# Altium project UZ_PER_loopback_tutorial.PrjPcb
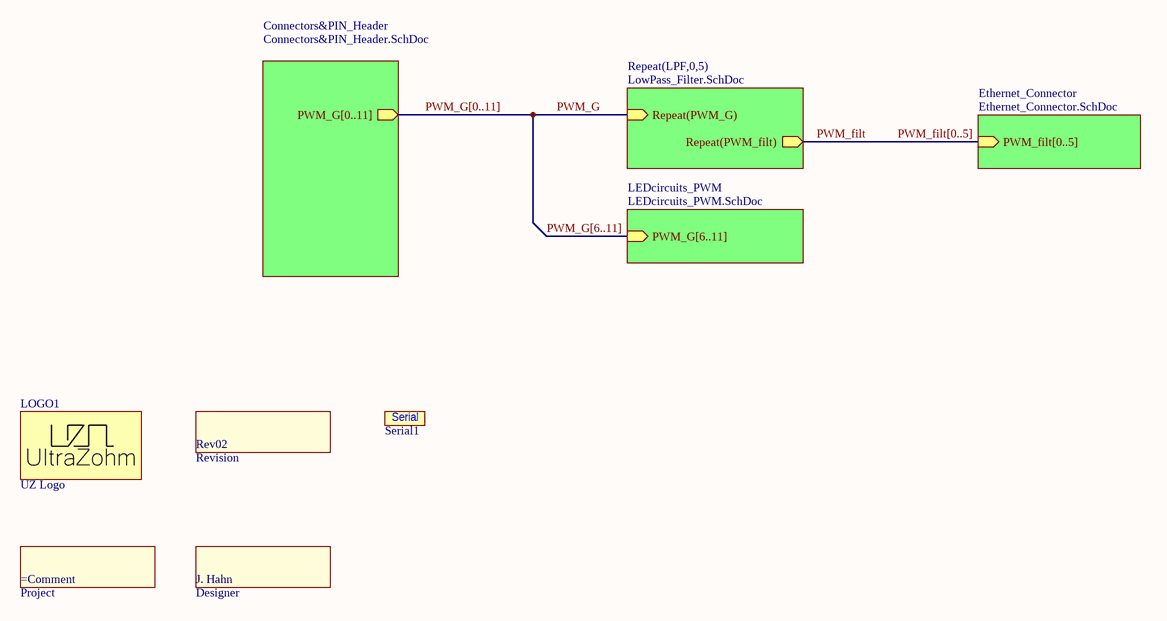
[diagram p0: Interface_TopSheet.SchDoc]
Author: J. Hahn; AuthorParam: J. Hahn; ProjectNameCustom: uz_per_loopback_tutorial; ProjectRevision: Rev02; Website: www.ultrazohm.com
5 sheets, 65 parts. Net scope: hierarchical (ports join the sheet entries above them; power ports are global).
Board file: UZ_PER_loopback_tutorial.PcbDoc
Sheets:
  Interface_TopSheet.SchDoc
    Connectors&PIN_Header = Connectors&PIN_Header.SchDoc
    LPF0 = LowPass_Filter.SchDoc
    LPF1 = LowPass_Filter.SchDoc
    LPF2 = LowPass_Filter.SchDoc
    LPF3 = LowPass_Filter.SchDoc
    LPF4 = LowPass_Filter.SchDoc
    LPF5 = LowPass_Filter.SchDoc
    Ethernet_Connector = Ethernet_Connector.SchDoc
    LEDcircuits_PWM = LEDcircuits_PWM.SchDoc

## Sheet Interface_TopSheet.SchDoc
size A4; Author: J. Hahn; CompanyName: Technische Hochschule Nürnberg Georg Simon Ohm; Organization: UltraZohm; Address1: Kesslerplatz 12; Address2: 90489 Nürnberg; Address3: GERMANY; SheetNumber: 1; SheetTotal: 5; Website: www.ultrazohm.com

### Parts
Designer  value J. Hahn  [Designator:comment]  (no BOM)
LOGO1  UZ Logo  [UZ_Logo_small]  (no BOM)
Project  (no value)  [COMMENT]  (no BOM)
Revision  value Rev02  [Designator:comment]  (no BOM)
Serial1  Serial #  [SERIAL]  (value not drawn)

### Sub-sheets
Connectors&PIN_Header = Connectors&PIN_Header.SchDoc: PWM_G[0..11] (out)
Ethernet_Connector = Ethernet_Connector.SchDoc: PWM_filt[0..5] (in)
LEDcircuits_PWM = LEDcircuits_PWM.SchDoc: PWM_G[6..11] (in)
Repeat(LPF,0,5) = LowPass_Filter.SchDoc: Repeat(PWM_G) (in), Repeat(PWM_filt) (out)

### Nets
PWM_filt: sheet Repeat(LPF,0,5)/Repeat(PWM_filt)
PWM_G: sheet Repeat(LPF,0,5)/Repeat(PWM_G)

### Buses and harness runs
bus PWM_filt[0..5] = sheet Ethernet_Connector/PWM_filt[0..5]
bus PWM_G[0..11] = sheet Connectors&PIN_Header/PWM_G[0..11]
bus PWM_G[6..11] = sheet LEDcircuits_PWM/PWM_G[6..11]

### Notes on the sheet
- Title
- Revision:
- Design Engineer:
- Date:
- Project:
- Sheet
- of
- (in symbol 6) Serial

### Library data of the parts
Designer = 4: Create a project parameter named "Author" this is the value of this component. It is printed on the PCB. Once the parameter is updated (e.g. new revision) it gets updated on the PCB as well; Manufacturer: PCB Manufacturer; Manufacturer Part Number: Project Author; Created from: T. Wendt; PartID: 4; Created On: 01.03.2021 08:53:41; Component Type: Project Author; Last Updated: 01.03.2021 09:20:27; Type: Standard (No BOM); Live Cycle Status: 1
LOGO1 = Logo small: Manufacturer: UltraZohm; Created from: MGremer; Created: Jan2021_Liegmann; Value: Logo; Manufacturer Part Number: Logo small; PartID: 10; Created On: 03.11.2021 09:04:23; ComponentLink1Description: https://docs.ultrazohm.com/; ComponentLink1URL: homepage; Component Type: Logo; Last Updated: 03.11.2021 09:05:50; Supplier 1: -; Supplier Part Number 1: -; Type: Logo; Live Cycle Status: 1
Project = 2: Create a project parameter named "ProjectNameCustom" this is the value of this component and it is printed on the PCB.; Manufacturer: PCB Manufacturer; Value: uz_per_loopback_tutorial; Created from: T. Wendt; PartID: 2; Created On: 01.03.2021 08:43:57; Component Type: Project Name; Last Updated: 01.03.2021 09:07:27; Manufacturer Part Number: Project Name; Type: Standard (No BOM); Live Cycle Status: 1
Revision = 3: Create a project parameter named "ProjectRevision" this is the value of this component. It is printed on the PCB. Once the parameter is updated (e.g. new revision) it gets updated on the PCB as well; Manufacturer: PCB Manufacturer; Created from: T. Wendt; PartID: 3; Created On: 01.03.2021 08:50:34; Component Type: Project Revision; Last Updated: 01.03.2021 09:28:36; Manufacturer Part Number: Project Revision; Type: Standard (No BOM); Live Cycle Status: 1
Serial1 = 6: Field to put in a serial number; Manufacturer: PCB Manufacturer; Created from: T. Wendt; PartID: 6; Created On: 02.03.2021 14:31:24; Component Type: Serial Number; Last Updated: 02.03.2021 14:31:24; Manufacturer Part Number: Serial Number; Type: Standard (No BOM); Live Cycle Status: 1

## Sheet Connectors&PIN_Header.SchDoc
size A4; Author: J. Hahn; CompanyName: Technische Hochschule Nürnberg Georg Simon Ohm; Organization: UltraZohm; Address1: Kesslerplatz 12; Address2: 90489 Nürnberg; Address3: GERMANY; SheetNumber: 2; SheetTotal: 5; Website: www.ultrazohm.com
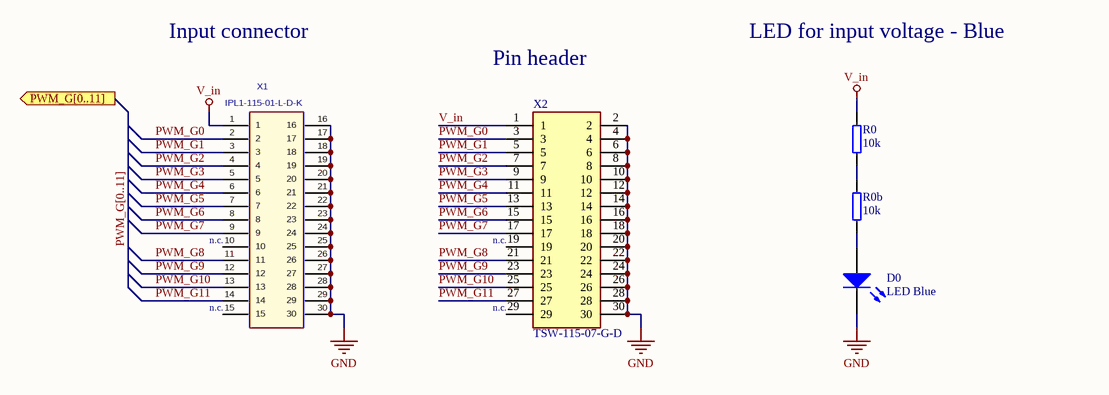
[diagram p1: Connectors&PIN_Header.SchDoc]

### Parts
D0  LED Blue  [WL-SMCW_0603]
R0  10k  [RES 0603_1608]
R0b  10k  [RES 0603_1608]
X1  IPL1-115-01-L-D-K  [IPL1-115-01-YYY-D-K]
X2  TSW-115-07-G-D  [TSW-115-XX-YY-D]

### Ports
PWM_G[0..11] (out)

### Nets
GND: D0.1(K) X1.16 X1.17 X1.18 X1.19 X1.20 X1.21 X1.22 X1.23 X1.24 X1.25 X1.26 X1.27 X1.28 X1.29 X1.30 X2.2 X2.4 X2.6 X2.8 X2.10 X2.12 X2.14 X2.16 X2.18 X2.20 X2.22 X2.24 X2.26 X2.28 X2.30
V_in: R0.2 X1.1 X2.1
PWM_G0: X1.2 X2.3
PWM_G1: X1.3 X2.5
PWM_G2: X1.4 X2.7
PWM_G3: X1.5 X2.9
PWM_G4: X1.6 X2.11
PWM_G5: X1.7 X2.13
PWM_G6: X1.8 X2.15
PWM_G7: X1.9 X2.17
PWM_G8: X1.11 X2.21
PWM_G9: X1.12 X2.23
PWM_G10: X1.13 X2.25
PWM_G11: X1.14 X2.27
NetD0_2: D0.2(A) R0b.1
NetR0_1: R0.1 R0b.2

Not connected (* = marked no-connect by the designer): X1 10 15; X2 19 29

### Buses and harness runs
bus PWM_G[0..11] = port PWM_G[0..11]

### Notes on the sheet
- Input connector
- LED for input voltage - Blue
- Pin header
- (near X1) n.c.
- (near X2) n.c.
- Title
- Revision:
- Design Engineer:
- Date:
- Project:
- Sheet
- of

### Library data of the parts
D0 = UZgen_LED_0603_Blue: Standard LEDs - SMD 0603 blue; Manufacturer: UZgen; Created from: UZgenTool; Manufacturer Part Number: UZgen_LED_0603_Blue; PartID: 20; Created On: 09.09.2024 10:45:01; ComponentLink1Description: N/A; ComponentLink1URL: N/A; Component Type: LED Diode; Device Package: 0603; Last Updated: 09.09.2024 10:45:01; Mounting Type: SMD; Supplier 1: LCSC; Supplier Part Number 1: C5197644; Type: Standard; Value: LED Blue; Live Cycle Status: 1; Stock number: not stored; Color: blue; LCSC Part Number: C5197644
R0 R0b = RQ73C1J10KBTD: SMD resistor 0.1%, 10ppm; Manufacturer: TE Connectivity; Created from: DHufnagel; Manufacturer Part Number: RQ73C1J10KBTD; PartID: 231; Created On: 14.12.2020 16:17:14; ComponentLink1Description: Datasheet; ComponentLink1URL: https://www.mouser.de/datasheet/2/418/5/ENG_DS_1773270_2_B-1533717.pdf; Component Type: SMD resistor; Device Package: 0603; Last Updated: 21.02.2024 15:51:17; Mounting Type: SMD; Supplier 1: Mouser; Supplier Part Number 1: 279-RQ73C1J10KBTD; Supplier 2: LCSC; Supplier Part Number 2: C25804; Type: Resistor; Tolerance: 0.1%; Value: 10k; Live Cycle Status: 1; Stock number: not stored; LCSC Part Number: C25804
X1 = IPL1-115-01-L-D-K: 2.54 mm Double Row Terminal Assembly; Manufacturer: SAMTEC; Created from: MGremer; Number of positions: 30; Manufacturer Part Number: IPL1-115-01-L-D-K; PartID: 28; Created On: 01.12.2020 18:14:32; ComponentLink1Description: Homepage; ComponentLink1URL: https://www.samtec.com/de/products/ipl1; Component Type: Samtec Connector; Device Package: Connector; Last Updated: 15.02.2021 10:08:03; Mounting Type: THT; Supplier 1: SAMTEC; Supplier Part Number 1: IPL1-115-01-L-D-K; Type: Connector; Live Cycle Status: 1; Number of rows: 2; Stock number: not stored; LCSC Part Number: C17431809
X2 = TSW-115-07-G-D: 2x15 Pins; Manufacturer_Name: SAMTEC; Created from: JHahn; Mouser Part Number: 200-TSW11507GD; Mouser Price/Stock: https://www.mouser.co.uk/ProductDetail/Samtec/TSW-115-07-G-D?qs=rU5fayqh%252BE0Fz7QdY5Xmuw%3D%3D; Manufacturer_Part_Number: TSW-115-07-G-D; Datasheet Link: http://suddendocs.samtec.com/prints/tsw-xxx-xx-xxx-x-xx-xxx-mkt.pdf; Manufacturer Part Number: TSW-115-07-G-D; PartID: 18; Created On: 07.04.2026 13:32:57; ComponentLink1Description: Datasheet; ComponentLink1URL: http://suddendocs.samtec.com/prints/tsw-xxx-xx-xxx-x-xx-xxx-mkt.pdf; Component Type: Pin Header; Device Package: THT; Last Updated: 07.04.2026 14:32:10; Manufacturer: SAMTEC; Mounting Type: THT; Operating Temperature: -55 +125 °C; Series: TSW; Supplier 1: Mouser; Supplier Part Number 1: 200-TSW11507GD; Type: Pin Header; Live Cycle Status: 1; LCSC Part Number: C5994596; Stock number: 15

## Sheet LowPass_Filter.SchDoc
size A4; Author: J. Hahn; CompanyName: Technische Hochschule Nürnberg Georg Simon Ohm; Organization: UltraZohm; Address1: Kesslerplatz 12; Address2: 90489 Nürnberg; Address3: GERMANY; SheetNumber: 3; SheetTotal: 5; Website: www.ultrazohm.com
Used 6 times, as channels LPF0, LPF1, LPF2, LPF3, LPF4, LPF5. Parts and nets are listed once, with the designators drawn on the sheet.
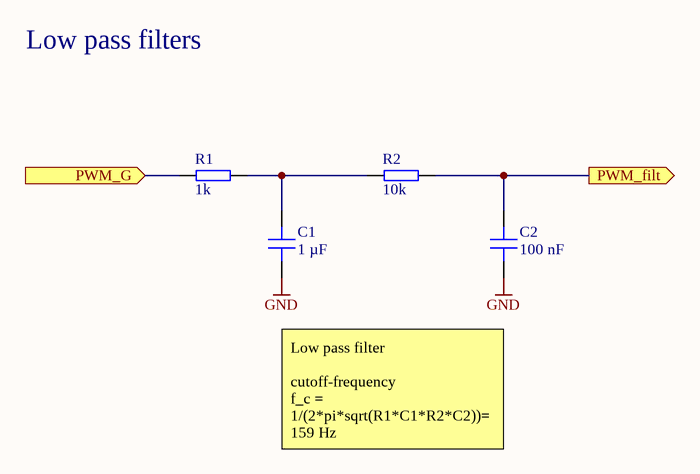
[diagram p2: LowPass_Filter.SchDoc]

### Parts
C1  1 µF  [C_0603]
C2  100 nF  [C_0603]
R1  1k  [RES 0603_1608]
R2  10k  [RES 0603_1608]

### Ports
PWM_filt (out), PWM_G (in)

### Nets
GND: C1.1 C2.1
PWM_filt: C2.2 R2.2 ; port PWM_filt
PWM_G: R1.1 ; port PWM_G
NetC1_2: C1.2 R1.2 R2.1

### Channels
LPF0: designators C1=LPF0_C1 C2=LPF0_C2 R1=LPF0_R1 R2=LPF0_R2; ports PWM_filt=PWM_filt0 PWM_G=PWM_G0
LPF1: designators C1=LPF1_C1 C2=LPF1_C2 R1=LPF1_R1 R2=LPF1_R2; ports PWM_filt=PWM_filt1 PWM_G=PWM_G1
LPF2: designators C1=LPF2_C1 C2=LPF2_C2 R1=LPF2_R1 R2=LPF2_R2; ports PWM_filt=PWM_filt2 PWM_G=PWM_G2
LPF3: designators C1=LPF3_C1 C2=LPF3_C2 R1=LPF3_R1 R2=LPF3_R2; ports PWM_filt=PWM_filt3 PWM_G=PWM_G3
LPF4: designators C1=LPF4_C1 C2=LPF4_C2 R1=LPF4_R1 R2=LPF4_R2; ports PWM_filt=PWM_filt4 PWM_G=PWM_G4
LPF5: designators C1=LPF5_C1 C2=LPF5_C2 R1=LPF5_R1 R2=LPF5_R2; ports PWM_filt=PWM_filt5 PWM_G=PWM_G5

### Notes on the sheet
- Low pass filters
- Low pass filter
  cutoff-frequency
  f_c = 1/(2*pi*sqrt(R1*C1*R2*C2))= 159 Hz
- Title
- Revision:
- Design Engineer:
- Date:
- Project:
- Sheet
- of

### Library data of the parts
C1 = UMK107AB7105KA-T: 50V 1uF X7R ±10% 0603 Multilayer Ceramic Capacitors MLCC - SMD/SMT ROHS; Manufacturer: Taiyo Yuden; Voltage Rating: 50 VDC; Created from: NDiringer; Manufacturer Part Number: UMK107AB7105KA-T; PartID: 98; Created On: 09.08.2022 09:35:02; ComponentLink1Description: Datasheet; ComponentLink1URL: https://www.mouser.de/datasheet/2/396/mlcc02_e-1307760.pdf; Component Type: Capacitor 0603; Device Package: 0603; Last Updated: 21.09.2022 16:11:37; Mounting Type: SMD; Operating Temperature: -55 - 125°C; Series: X7R; Supplier 1: LCSC; Supplier Part Number 1: C15849; Supplier 2: Mouser; Supplier Part Number 2: 963-UMK107AB7105MA-T; Type: Capacitor; Tolerance: 10 %; Value: 1 µF; Live Cycle Status: 1; LCSC Part Number: C15849; Stock number: not stored
C2 = C0603C104K5RAC3121: Capacitor 0603, 50 VDC, 100nF, X7R; Manufacturer: KEMET; Tolerance: 10 %; Voltage Rating: 50 VDC; Created from: DHufnagel; Manufacturer Part Number: C0603C104K5RAC3121; PartID: 99; Created On: 11.08.2022 14:33:29; ComponentLink1Description: Datasheet; ComponentLink1URL: https://www.mouser.de/datasheet/2/212/KEM_C1023_X7R_AUTO_SMD-1093309.pdf; Component Type: Capacitor 0603; Device Package: 0603; Last Updated: 19.08.2022 08:26:58; Mounting Type: SMD; Operating Temperature: -55 - 125°C; Series: X7R; Supplier 1: Mouser; Supplier Part Number 1: 80-C603C104K5RAC3121; Supplier 2: LCSC; Supplier Part Number 2: C14663; Type: Capacitor; Value: 100 nF; Live Cycle Status: 1; LCSC Part Number: C14663; Stock number: not stored
R1 = PCF-W0603LF-03-1001-B-P-LT: SMD resistor 0.1%; Manufacturer: IRC / TT Electronics; Created from: MGremer; Manufacturer Part Number: PCF-W0603LF-03-1001-B-P-LT; PartID: 163; Created On: 14.12.2020 16:17:14; ComponentLink1Description: Datasheet; ComponentLink1URL: https://www.mouser.de/datasheet/2/414/PCF-1528243.pdf; Component Type: SMD resistor; Device Package: 0603; Last Updated: 21.02.2024 15:45:55; Mounting Type: SMD; Supplier 1: Mouser; Supplier Part Number 1: 66-PCFW0603LF031001B; Type: Resistor; Tolerance: 0.1%; Value: 1k; Live Cycle Status: 1; Stock number: not stored; LCSC Part Number: C110776
R2 = RQ73C1J10KBTD: as R0 on sheet Connectors&PIN_Header; Manufacturer Part Number: RQ73C1J10KBTD; PartID: 231; Created On: 14.12.2020 16:17:14; ComponentLink1Description: Datasheet; ComponentLink1URL: https://www.mouser.de/datasheet/2/418/5/ENG_DS_1773270_2_B-1533717.pdf; Component Type: SMD resistor; Device Package: 0603; Last Updated: 21.02.2024 15:51:17; Mounting Type: SMD; Supplier 1: Mouser; Supplier Part Number 1: 279-RQ73C1J10KBTD; Supplier 2: LCSC; Supplier Part Number 2: C25804; Type: Resistor; Tolerance: 0.1%; Value: 10k; Live Cycle Status: 1; Stock number: not stored; LCSC Part Number: C25804

## Sheet Ethernet_Connector.SchDoc
size A4; Author: J. Hahn; CompanyName: Technische Hochschule Nürnberg Georg Simon Ohm; Organization: UltraZohm; Address1: Kesslerplatz 12; Address2: 90489 Nürnberg; Address3: GERMANY; SheetNumber: 5; SheetTotal: 5; Website: www.ultrazohm.com
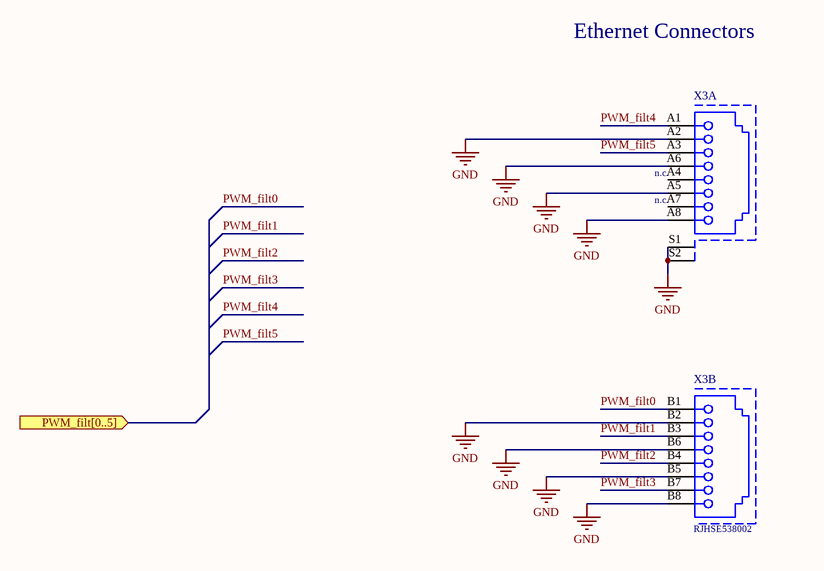
[diagram p3: Ethernet_Connector.SchDoc]

### Parts
X3  (no value)  [RJHSE-5380-02]  (parts A,B of 2)

### Ports
PWM_filt[0..5] (in)

### Nets
GND: X3.A2 X3.A5 X3.A6 X3.A8 X3.B2 X3.B5 X3.B6 X3.B8 X3.S1 X3.S2
PWM_filt0: X3.B1
PWM_filt1: X3.B3
PWM_filt2: X3.B4
PWM_filt3: X3.B7
PWM_filt4: X3.A1
PWM_filt5: X3.A3

Not connected (* = marked no-connect by the designer): X3 A4 A7

### Notes on the sheet
- Ethernet Connectors
- (near X3) n.c.
- Title
- Revision:
- Design Engineer:
- Date:
- Project:
- Sheet
- of

### Library data of the parts
X3 = RJHSE538002: CAT5, RJ45 Connector, 1x2; Manufacturer: Amphenol; Created from: MGremer; Manufacturer Part Number: RJHSE538002; PartID: 4; Created On: 22.02.2021 16:43:38; ComponentLink1Description: Datasheet; ComponentLink1URL: https://www.farnell.com/cad/2360382.pdf; Component Type: RJ45 Connector; Device Package: RJ45; Last Updated: 22.02.2021 16:43:38; Mounting Type: THT; Series: RJHSE; Supplier 1: Farnell; Supplier Part Number 1: 1860605; Type: RJ45 Connector; Live Cycle Status: 1; Stock number: not stored; LCSC Part Number: C47326523

## Sheet LEDcircuits_PWM.SchDoc
size A4; Author: J. Hahn; CompanyName: Technische Hochschule Nürnberg Georg Simon Ohm; Organization: UltraZohm; Address1: Kesslerplatz 12; Address2: 90489 Nürnberg; Address3: GERMANY; SheetNumber: 4; SheetTotal: 5; Website: www.ultrazohm.com
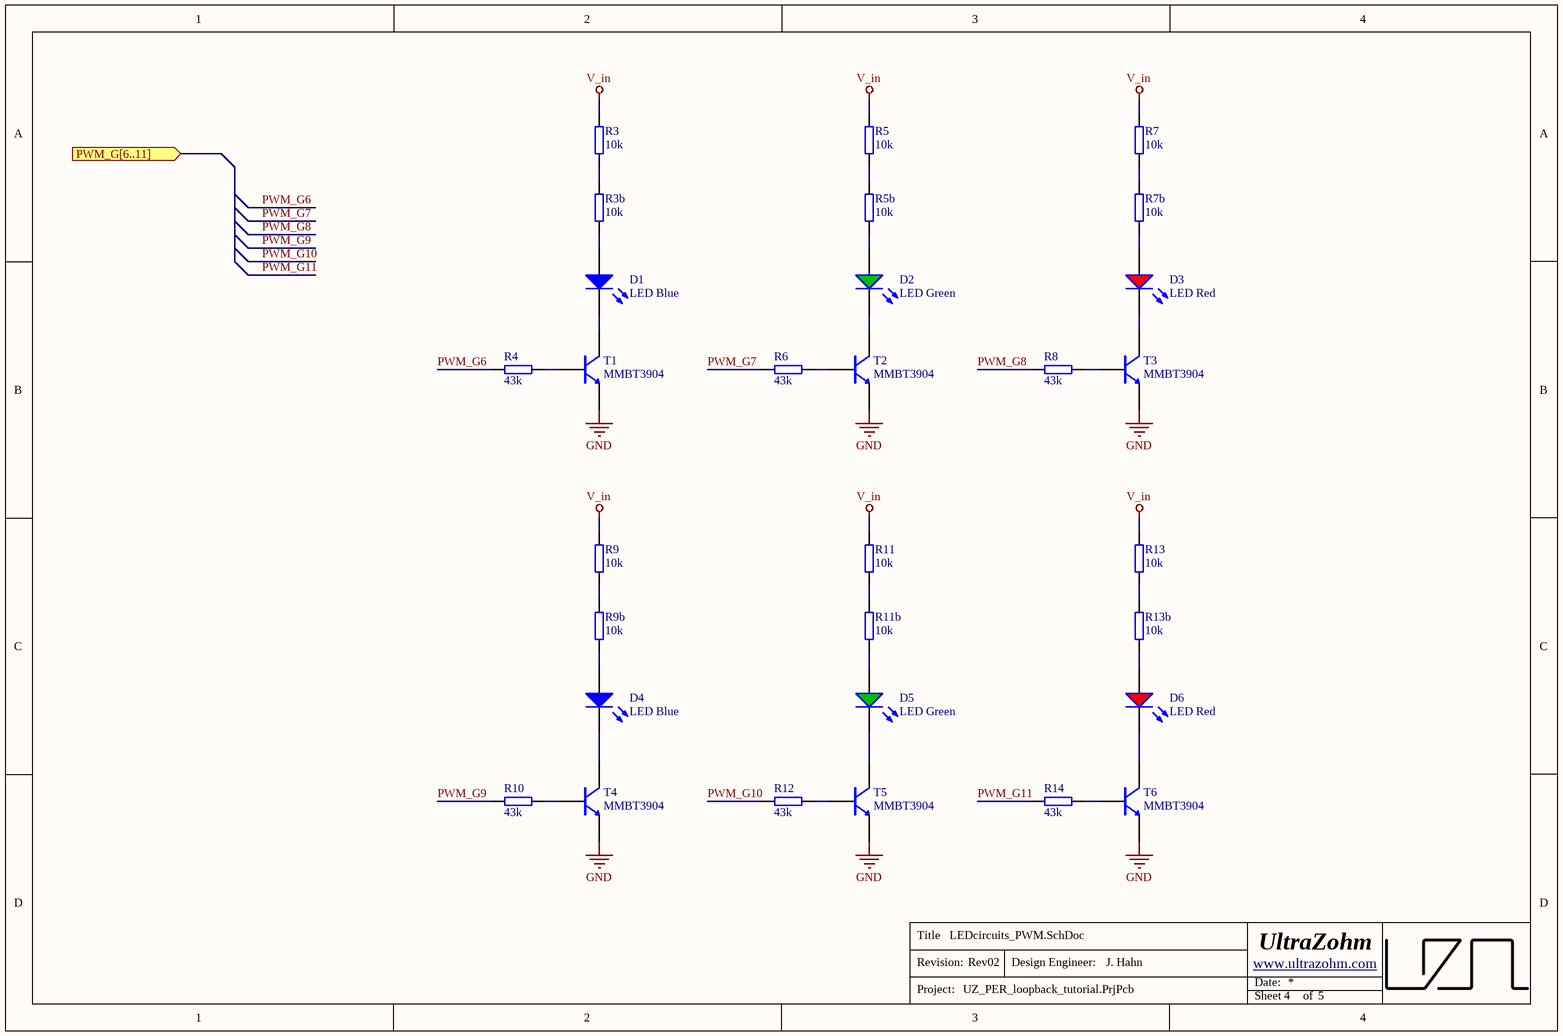
[diagram p4: LEDcircuits_PWM.SchDoc]

### Parts
D1  LED Blue  [WL-SMCW_0603]
D2  LED Green  [WL-SMCW_0603]
D3  LED Red  [WL-SMCW_0603]
D4  LED Blue  [WL-SMCW_0603]
D5  LED Green  [WL-SMCW_0603]
D6  LED Red  [WL-SMCW_0603]
R3  10k  [RES 0603_1608]
R3b  10k  [RES 0603_1608]
R4  43k  [RES 0603_1608]
R5  10k  [RES 0603_1608]
R5b  10k  [RES 0603_1608]
R6  43k  [RES 0603_1608]
R7  10k  [RES 0603_1608]
R7b  10k  [RES 0603_1608]
R8  43k  [RES 0603_1608]
R9  10k  [RES 0603_1608]
R9b  10k  [RES 0603_1608]
R10  43k  [RES 0603_1608]
R11  10k  [RES 0603_1608]
R11b  10k  [RES 0603_1608]
R12  43k  [RES 0603_1608]
R13  10k  [RES 0603_1608]
R13b  10k  [RES 0603_1608]
R14  43k  [RES 0603_1608]
T1  MMBT3904  [SOT95P280X145-3N]
T2  MMBT3904  [SOT95P280X145-3N]
T3  MMBT3904  [SOT95P280X145-3N]
T4  MMBT3904  [SOT95P280X145-3N]
T5  MMBT3904  [SOT95P280X145-3N]
T6  MMBT3904  [SOT95P280X145-3N]

### Ports
PWM_G[6..11] (in)

### Nets
GND: T1.2(EMITTER) T2.2(EMITTER) T3.2(EMITTER) T4.2(EMITTER) T5.2(EMITTER) T6.2(EMITTER)
V_in: R3.2 R5.2 R7.2 R9.2 R11.2 R13.2
PWM_G6: R4.1
PWM_G7: R6.1
PWM_G8: R8.1
PWM_G9: R10.1
PWM_G10: R12.1
PWM_G11: R14.1
NetD1_1: D1.1(K) T1.3(COLLECTOR)
NetD1_2: D1.2(A) R3b.1
NetD2_1: D2.1(K) T2.3(COLLECTOR)
NetD2_2: D2.2(A) R5b.1
NetD3_1: D3.1(K) T3.3(COLLECTOR)
NetD3_2: D3.2(A) R7b.1
NetD4_1: D4.1(K) T4.3(COLLECTOR)
NetD4_2: D4.2(A) R9b.1
NetD5_1: D5.1(K) T5.3(COLLECTOR)
NetD5_2: D5.2(A) R11b.1
NetD6_1: D6.1(K) T6.3(COLLECTOR)
NetD6_2: D6.2(A) R13b.1
NetR3_1: R3.1 R3b.2
NetR4_2: R4.2 T1.1(BASIS)
NetR5_1: R5.1 R5b.2
NetR6_2: R6.2 T2.1(BASIS)
NetR7_1: R7.1 R7b.2
NetR8_2: R8.2 T3.1(BASIS)
NetR9_1: R9.1 R9b.2
NetR10_2: R10.2 T4.1(BASIS)
NetR11_1: R11.1 R11b.2
NetR12_2: R12.2 T5.1(BASIS)
NetR13_1: R13.1 R13b.2
NetR14_2: R14.2 T6.1(BASIS)

### Notes on the sheet
- Title
- Revision:
- Design Engineer:
- Date:
- Project:
- Sheet
- of

### Library data of the parts
D1 D4 = UZgen_LED_0603_Blue: as D0 on sheet Connectors&PIN_Header; Manufacturer Part Number: UZgen_LED_0603_Blue; PartID: 20; Created On: 09.09.2024 10:45:01; ComponentLink1Description: N/A; ComponentLink1URL: N/A; Component Type: LED Diode; Device Package: 0603; Last Updated: 09.09.2024 10:45:01; Mounting Type: SMD; Supplier 1: LCSC; Supplier Part Number 1: C5197644; Type: Standard; Value: LED Blue; Live Cycle Status: 1; Stock number: not stored; Color: blue; LCSC Part Number: C5197644
D2 D5 = UZgen_LED_0603_Green: Standard LEDs - SMD 0603 green; Manufacturer: UZgen; Created from: UZgenTool; Manufacturer Part Number: UZgen_LED_0603_Green; PartID: 21; Created On: 09.09.2024 10:45:01; ComponentLink1Description: N/A; ComponentLink1URL: N/A; Component Type: LED Diode; Device Package: 0603; Last Updated: 09.09.2024 10:45:01; Mounting Type: SMD; Supplier 1: LCSC; Supplier Part Number 1: C5252984; Type: Standard; Value: LED Green; Live Cycle Status: 1; Stock number: not stored; Color: green; LCSC Part Number: C5252984
D3 D6 = UZgen_LED_0603_Red: Standard LEDs - SMD 0603 red; Manufacturer: UZgen; Created from: UZgenTool; Manufacturer Part Number: UZgen_LED_0603_Red; PartID: 22; Created On: 09.09.2024 10:45:01; ComponentLink1Description: N/A; ComponentLink1URL: N/A; Component Type: LED Diode; Device Package: 0603; Last Updated: 09.09.2024 10:45:01; Mounting Type: SMD; Supplier 1: LCSC; Supplier Part Number 1: C3030991; Type: Standard; Value: LED Red; Live Cycle Status: 1; Stock number: not stored; Color: red; LCSC Part Number: C3030991
R3 R3b R5 R5b R7 R7b R9 R9b R11 R11b R13 R13b = RQ73C1J10KBTD: as R0 on sheet Connectors&PIN_Header; Manufacturer Part Number: RQ73C1J10KBTD; PartID: 231; Created On: 14.12.2020 16:17:14; ComponentLink1Description: Datasheet; ComponentLink1URL: https://www.mouser.de/datasheet/2/418/5/ENG_DS_1773270_2_B-1533717.pdf; Component Type: SMD resistor; Device Package: 0603; Last Updated: 21.02.2024 15:51:17; Mounting Type: SMD; Supplier 1: Mouser; Supplier Part Number 1: 279-RQ73C1J10KBTD; Supplier 2: LCSC; Supplier Part Number 2: C25804; Type: Resistor; Tolerance: 0.1%; Value: 10k; Live Cycle Status: 1; Stock number: not stored; LCSC Part Number: C25804
R4 R6 R8 R10 R12 R14 = RK73B1JTTD433J: SMD resistor E24 series; Manufacturer: KOA Speer; Tolerance: 5%; Created from: MGremer; Manufacturer Part Number: RK73B1JTTD433J; PartID: 113; Created On: 14.12.2020 16:17:14; ComponentLink1Description: Datasheet; ComponentLink1URL: https://www.mouser.de/datasheet/2/219/RK73B-1825463.pdf; Component Type: SMD resistor; Device Package: 0603; Last Updated: 15.02.2023 17:49:44; Mounting Type: SMD; Supplier 1: Mouser; Supplier Part Number 1: 660-RK73B1JTTD433J; Type: Resistor; Value: 43k; Live Cycle Status: 1; Stock number: Labor SMD Container; LCSC Part Number: C23172
T1-T6 = MMBT3904: Bipolartransistor, 40V 200mW 200mA 100@10mA,1V 300MHz 300mV@50mA,5mA NPN +150℃@(Tj) SOT-23(SOT-23-3); Manufacturer: Jiangsu Changjing Electronics Technology Co., Ltd.; Number Of Channels: single; Collector Basis Voltage: 60 V; Created from: NDiringer; Manufacturer Part Number: MMBT3904; PartID: 2; Created On: 10.06.2022 12:04:49; ComponentLink1Description: Datasheet; ComponentLink1URL: https://datasheet.lcsc.com/lcsc/1811011934_Jiangsu-Changjing-Electronics-Technology-Co---Ltd--MMBT3904_C20526.pdf; Component Type: Bipolartransistor; Device Package: SOT-23-3; Last Updated: 10.08.2022 13:48:16; Mounting Type: SMD; Operating Temperature: -55 - 150 °C; Series: MMBT3904; Supplier 1: Mouser; Supplier Part Number 1: MMBT3904; Type: Bipolartransistor; Collector Emitter Voltage: 40 V; Polarization: NPN; Power Dissipation: 200 mW; Value: 40 V; Live Cycle Status: 1; Supplier 2: LCSC/JLCPCB; Supplier Part Number 2: C20526; LCSC Part Number: C20526

## Nets that join several sheets
GND: Connectors&PIN_Header (31 pins), LPF0 (LPF0_C1.1 LPF0_C2.1), LPF1 (LPF1_C1.1 LPF1_C2.1), LPF2 (LPF2_C1.1 LPF2_C2.1), LPF3 (LPF3_C1.1 LPF3_C2.1), LPF4 (LPF4_C1.1 LPF4_C2.1), LPF5 (LPF5_C1.1 LPF5_C2.1), Ethernet_Connector (10 pins), LEDcircuits_PWM (6 pins)
V_in: Connectors&PIN_Header (R0.2 X1.1 X2.1), LEDcircuits_PWM (6 pins)
PWM_G0: Connectors&PIN_Header (X1.2 X2.3), LPF0 (LPF0_R1.1)
PWM_G1: Connectors&PIN_Header (X1.3 X2.5), LPF1 (LPF1_R1.1)
PWM_G2: Connectors&PIN_Header (X1.4 X2.7), LPF2 (LPF2_R1.1)
PWM_G3: Connectors&PIN_Header (X1.5 X2.9), LPF3 (LPF3_R1.1)
PWM_G4: Connectors&PIN_Header (X1.6 X2.11), LPF4 (LPF4_R1.1)
PWM_G5: Connectors&PIN_Header (X1.7 X2.13), LPF5 (LPF5_R1.1)